# EAGLE design main (EAGLE 6.5.0)
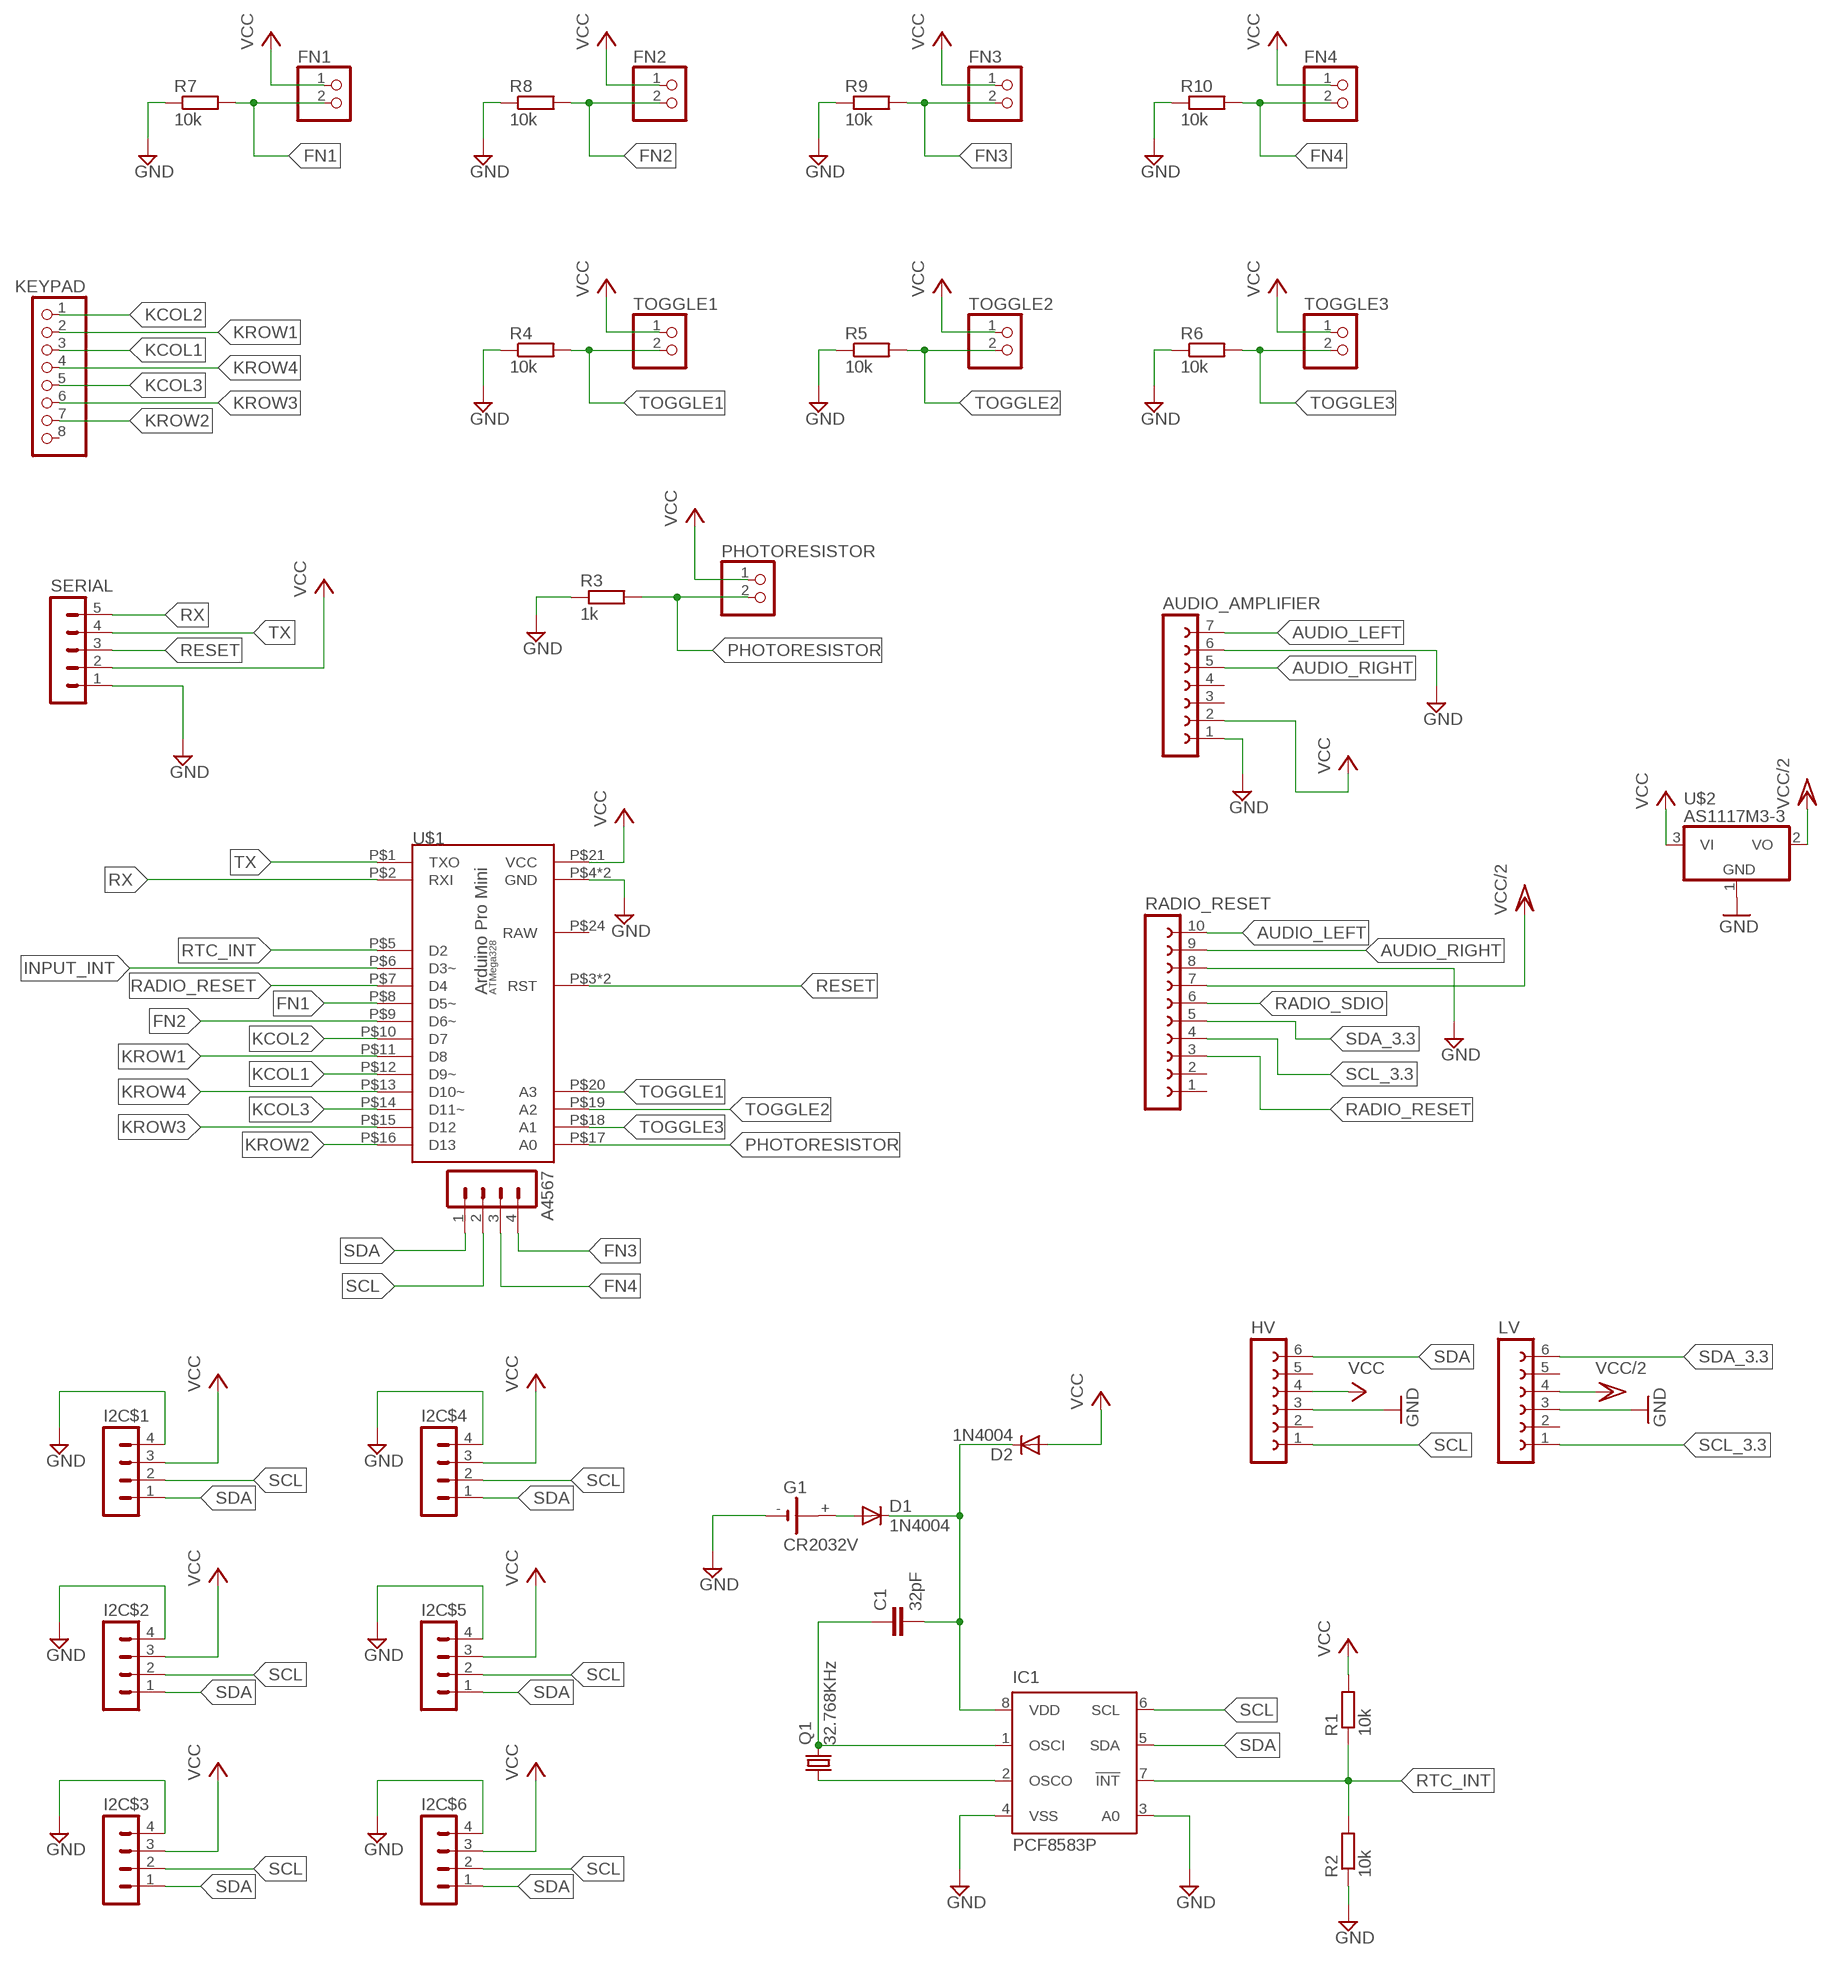
[diagram p0: schematic, sheet 1]

## Parts
A4567  MA04-1  [MA04-1]
AUDIO_AMPLIFIER  FE07-1  [FE07]
C1  32pF  C-EU025-024X044  [C025-024X044]
D1  1N4004  [DO41-10]
D2  1N4004  [DO41-10]
FN1  PINHD-1X2  [1X02]
FN2  PINHD-1X2  [1X02]
FN3  PINHD-1X2  [1X02]
FN4  PINHD-1X2  [1X02]
G1  CR2032V  [CR2032V]
HV  FE06-1  [FE06]
I2C$1  MA04-1  [MA04-1]
I2C$2  MA04-1  [MA04-1]
I2C$3  MA04-1  [MA04-1]
I2C$4  MA04-1  [MA04-1]
I2C$5  MA04-1  [MA04-1]
I2C$6  MA04-1  [MA04-1]
IC1  PCF8583P  [DIL08]
KEYPAD  PINHD-1X8  [1X08]
LV  FE06-1  [FE06]
PHOTORESISTOR  PINHD-1X2  [1X02]
Q1  32.768KHz  CRYSTALTC26H  [TC26H]
R1  10k  R-EU_M0805  [M0805]
R2  10k  R-EU_M0805  [M0805]
R3  1k  R-EU_M0805  [M0805]
R4  10k  R-EU_M0805  [M0805]
R5  10k  R-EU_M0805  [M0805]
R6  10k  R-EU_M0805  [M0805]
R7  10k  R-EU_M0805  [M0805]
R8  10k  R-EU_M0805  [M0805]
R9  10k  R-EU_M0805  [M0805]
R10  10k  R-EU_M0805  [M0805]
RADIO_RESET  FE10-1  [FE10]
SERIAL  MA05-1  [MA05-1]
TOGGLE1  PINHD-1X2  [1X02]
TOGGLE2  PINHD-1X2  [1X02]
TOGGLE3  PINHD-1X2  [1X02]
U$1  ARDUINO-PRO-MINI-BARE  [DIP24W]
U$2  AS1117M3-3  [SOT223]

## Nets
AUDIO_LEFT: AUDIO_AMPLIFIER.7 RADIO_RESET.10
AUDIO_RIGHT: AUDIO_AMPLIFIER.5 RADIO_RESET.9
FN1: FN1.2 R7.2 U$1.P$8(D5~)
FN2: FN2.2 R8.2 U$1.P$9(D6~)
FN3: A4567.4 FN3.2 R9.2
FN4: A4567.3 FN4.2 R10.2
GND: AUDIO_AMPLIFIER.1 AUDIO_AMPLIFIER.6 G1.- HV.3 I2C$1.4 I2C$2.4 I2C$3.4 I2C$4.4 I2C$5.4 I2C$6.4 IC1.3(A0) IC1.4(VSS) LV.3 R2.1 R3.1 R4.1 R5.1 R6.1 R7.1 R8.1 R9.1 R10.1 RADIO_RESET.8 SERIAL.1 U$1.P$4(GND) U$1.P$23(GND) U$2.1(GND)
INPUT_INT: U$1.P$6(D3~)
KCOL1: KEYPAD.3 U$1.P$12(D9~)
KCOL2: KEYPAD.1 U$1.P$10(D7)
KCOL3: KEYPAD.5 U$1.P$14(D11~)
KROW1: KEYPAD.2 U$1.P$11(D8)
KROW2: KEYPAD.7 U$1.P$16(D13)
KROW3: KEYPAD.6 U$1.P$15(D12)
KROW4: KEYPAD.4 U$1.P$13(D10~)
N$1: C1.1 IC1.1(OSCI) Q1.2
N$2: IC1.2(OSCO) Q1.1
N$3: D1.A G1.+
N$4: C1.2 D1.C D2.C IC1.8(VDD)
PHOTORESISTOR: PHOTORESISTOR.2 R3.2 U$1.P$17(A0)
RADIO_RESET: RADIO_RESET.3 U$1.P$7(D4)
RADIO_SDIO: RADIO_RESET.6
RESET: SERIAL.3 U$1.P$3(RST) U$1.P$22(RST)
RTC_INT: IC1.7(!INT) R1.1 R2.2 U$1.P$5(D2)
RX: SERIAL.5 U$1.P$2(RXI)
SCL: A4567.2 HV.1 I2C$1.2 I2C$2.2 I2C$3.2 I2C$4.2 I2C$5.2 I2C$6.2 IC1.6(SCL)
SCL_3.3: LV.1 RADIO_RESET.4
SDA: A4567.1 HV.6 I2C$1.1 I2C$2.1 I2C$3.1 I2C$4.1 I2C$5.1 I2C$6.1 IC1.5(SDA)
SDA_3.3: LV.6 RADIO_RESET.5
TOGGLE1: R4.2 TOGGLE1.2 U$1.P$20(A3)
TOGGLE2: R5.2 TOGGLE2.2 U$1.P$19(A2)
TOGGLE3: R6.2 TOGGLE3.2 U$1.P$18(A1)
TX: SERIAL.4 U$1.P$1(TXO)
VCC: AUDIO_AMPLIFIER.2 D2.A FN1.1 FN2.1 FN3.1 FN4.1 HV.4 I2C$1.3 I2C$2.3 I2C$3.3 I2C$4.3 I2C$5.3 I2C$6.3 PHOTORESISTOR.1 R1.2 SERIAL.2 TOGGLE1.1 TOGGLE2.1 TOGGLE3.1 U$1.P$21(VCC) U$2.3(VI)
VCC/2: LV.4 RADIO_RESET.7 U$2.2(VO)
Unconnected: AUDIO_AMPLIFIER.3 AUDIO_AMPLIFIER.4 G1.+@1(+) HV.2 HV.5 KEYPAD.8 LV.2 LV.5 RADIO_RESET.1 RADIO_RESET.2 U$1.P$24(RAW)

## Library data of the parts
A4567 I2C$1-I2C$6 = con-lstb:MA04-1: PIN HEADER; OC_FARNELL: unknown; OC_NEWARK: unknown
AUDIO_AMPLIFIER = con-lsta:FE07-1: FEMALE HEADER; OC_FARNELL: unknown; OC_NEWARK: unknown
C1 = rcl:C-EU: CAPACITOR, European symbol
D1 D2 = diode:1N4004: DIODE general purpose rectifier, 1 A
FN1-FN4 PHOTORESISTOR TOGGLE1-TOGGLE3 = pinhead:PINHD-1X2: PIN HEADER
G1 = battery:CR2032V: LI BATTERY Varta
HV LV = con-lsta:FE06-1: FEMALE HEADER; OC_FARNELL: unknown; OC_NEWARK: unknown
IC1 = ds1307_pcf8583:PCF8583: I2C-Bus CLOCK/CALENDAR
KEYPAD = pinhead:PINHD-1X8: PIN HEADER
Q1 = crystal:CRYSTAL: CRYSTAL; OC_FARNELL: unknown; OC_NEWARK: unknown
R1 R2 R4-R10 = resistor:R-EU_: RESISTOR, European symbol
R3 = rcl:R-EU_: RESISTOR, European symbol
RADIO_RESET = con-lsta:FE10-1: FEMALE HEADER; OC_FARNELL: unknown; OC_NEWARK: unknown
SERIAL = con-lstb:MA05-1: PIN HEADER; OC_FARNELL: unknown; OC_NEWARK: unknown
U$1 = arduino-pro-mini:ARDUINO-PRO-MINI-BARE
U$2 = linear_mod_by_bwa:AS1117M3-3

## Board
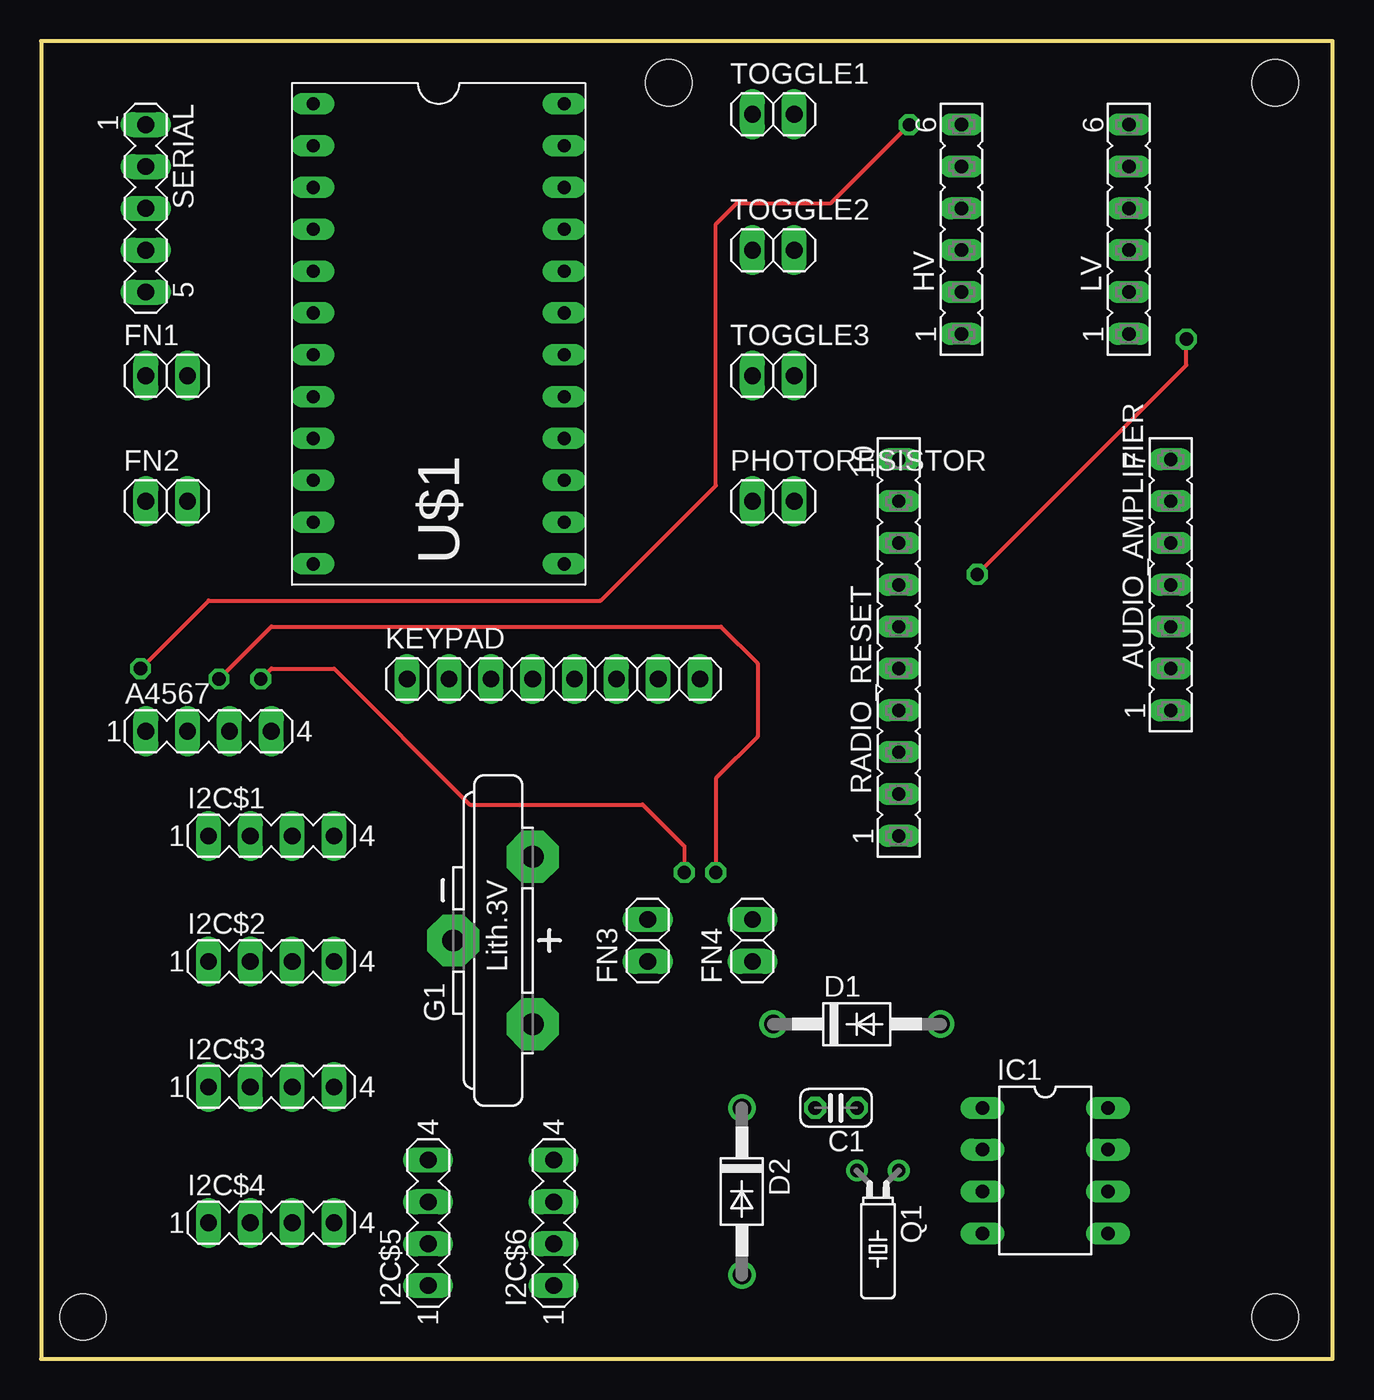
[diagram p1: board, top side]
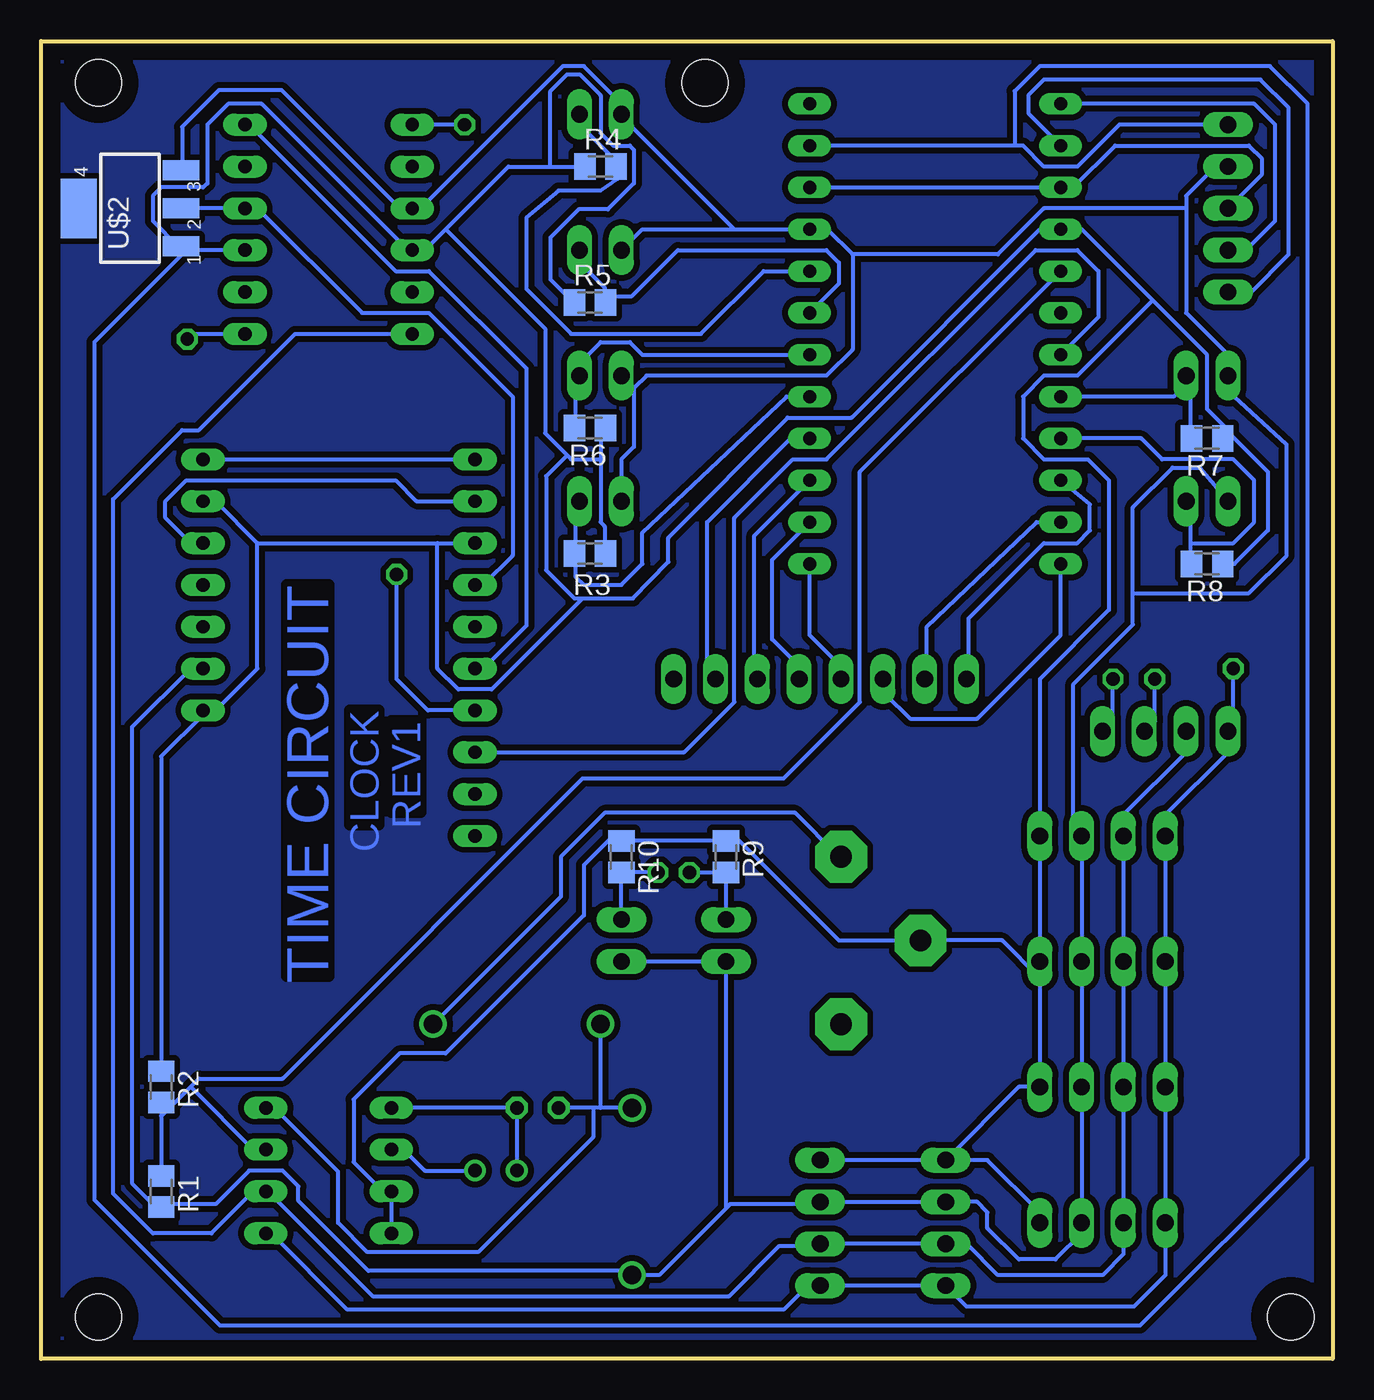
[diagram p2: board, bottom side, seen from below]

Size 78.41 x 80 mm. Coordinates in mm from the lower left corner, seen from the top.
Outline: 0,0 78.41,0 78.41,80 0,80 0,0
Copper layers (1*16): Top 0.035mm / dielectric 1.5mm / Bottom 0.035mm
Design rules "default *": minimum track width 10mil, minimum drill 24mil, track to track 14mil, track to pad 14mil, pad to pad 14mil, via to via 14mil, smd to smd 14mil, copper to edge 40mil, drill to drill 8mil, minimum pad ring 10mil, minimum via ring 8mil, stop-mask expansion 4mil, vias tented up to drill 0mil, thermal gap 10mil
Holes 2.8 mm at 74.93,77.47 2.54,2.54 74.93,2.54 38.1,77.47

### Footprints (pad centres in the part's own frame; a part is rotated, then mirrored left to right if it is on the bottom)
MA04-1 = drill 1.016 long: 1 -3.81,0; 2 -1.27,0; 3 1.27,0; 4 3.81,0
FE07 = drill 0.813 long: 1 -7.62,0; 2 -5.08,0; 3 -2.54,0; 4 0,0; 5 2.54,0; 6 5.08,0; 7 7.62,0
C025-024X044 = drill 0.813 octagon: 1 -1.27,0; 2 1.27,0
DO41-10 = drill 1.118: A 5.08,0; C -5.08,0
1X02 = drill 1.016 long: 1 -1.27,0; 2 1.27,0
CR2032V = drill 1.321 pad 3.15 octagon: + -2.54,-5.08; +@1 -2.54,5.08; - 2.286,0
FE06 = drill 0.813 long: 1 -6.35,0; 2 -3.81,0; 3 -1.27,0; 4 1.27,0; 5 3.81,0; 6 6.35,0
DIL08 = drill 0.813 long: 1 -3.81,-3.81; 2 -1.27,-3.81; 3 1.27,-3.81; 4 3.81,-3.81; 5 3.81,3.81; 6 1.27,3.81; 7 -1.27,3.81; 8 -3.81,3.81
1X08 = drill 1.016 long: 1 -8.89,0; 2 -6.35,0; 3 -3.81,0; 4 -1.27,0; 5 1.27,0; 6 3.81,0; 7 6.35,0; 8 8.89,0
TC26H = drill 0.813: 1 -1.27,0; 2 1.27,0
M0805 = smd 1.3 x 1.6: 1 -0.95,0; 2 0.95,0
FE10 = drill 0.813 long: 1 -11.43,0; 2 -8.89,0; 3 -6.35,0; 4 -3.81,0; 5 -1.27,0; 6 1.27,0; 7 3.81,0; 8 6.35,0; 9 8.89,0; 10 11.43,0
MA05-1 = drill 1.016 long: 1 -5.08,0; 2 -2.54,0; 3 0,0; 4 2.54,0; 5 5.08,0
DIP24W = drill 0.8 pad 1.27 long: P$1 -7.62,13.97; P$2 -7.62,11.43; P$3 -7.62,8.89; P$4 -7.62,6.35; P$5 -7.62,3.81; P$6 -7.62,1.27; P$7 -7.62,-1.27; P$8 -7.62,-3.81; P$9 -7.62,-6.35; P$10 -7.62,-8.89; P$11 -7.62,-11.43; P$12 -7.62,-13.97; P$13 7.62,-13.97; P$14 7.62,-11.43; P$15 7.62,-8.89; P$16 7.62,-6.35; P$17 7.62,-3.81; P$18 7.62,-1.27; P$19 7.62,1.27; P$20 7.62,3.81; P$21 7.62,6.35; P$22 7.62,8.89; P$23 7.62,11.43; P$24 7.62,13.97
SOT223 = smd 1.219 x 2.235: 1 -2.311,-3.099; 2 0,-3.099; 3 2.311,-3.099 | smd 3.6 x 2.2: 4 0,3.099

### Placement (x,y rotation side)
A4567  10.16,38.1 0 top
AUDIO_AMPLIFIER  68.58,46.99 90 top
C1  48.26,15.24 180 top
D1  49.53,20.32 0 top
D2  42.55,10.16 270 top
FN1  7.62,59.69 0 top
FN2  7.62,52.07 0 top
FN3  36.83,25.4 90 top
FN4  43.18,25.4 90 top
G1  27.3,25.4 180 top
HV  55.88,68.58 90 top
I2C$1  13.97,31.75 0 top
I2C$2  13.97,24.13 0 top
I2C$3  13.97,16.51 0 top
I2C$4  13.97,8.26 0 top
I2C$5  23.5,8.26 90 top
I2C$6  31.11,8.26 90 top
IC1  60.96,11.43 270 top
KEYPAD  31.11,41.27 0 top
LV  66.04,68.58 90 top
PHOTORESISTOR  44.45,52.07 0 top
Q1  50.8,11.43 180 top
R1  71.12,10.16 270 bottom
R2  71.12,16.51 270 bottom
R3  45.09,48.9 180 bottom
R4  44.45,72.39 0 bottom
R5  45.09,64.14 0 bottom
R6  45.09,56.52 180 bottom
R7  7.62,55.88 180 bottom
R8  7.62,48.26 180 bottom
R9  36.83,30.48 270 bottom
R10  43.18,30.48 270 bottom
RADIO_RESET  52.07,43.18 90 top
SERIAL  6.35,69.85 270 top
TOGGLE1  44.45,75.56 0 top
TOGGLE2  44.45,67.31 0 top
TOGGLE3  44.45,59.69 0 top
U$1  24.13,62.23 0 top
U$2  73.03,69.85 90 bottom

### Tracks (layer width: path | path; a pad name or v marks a point on that pad's centre or on a via)
AUDIO_LEFT
  Bottom 0.254: AUDIO_AMPLIFIER.7 RADIO_RESET.10
AUDIO_RIGHT
  Bottom 0.254: RADIO_RESET.9 55.63,52.07 56.9,53.34 69.6,53.34 70.87,52.07 70.87,51.05 69.34,49.53 AUDIO_AMPLIFIER.5
FN1
  Bottom 0.254: 8.64,59.44 8.64,55.88 R7.2 | U$1.P$8 9.65,58.42 8.64,59.44 | 8.64,59.44 FN1.2
FN2
  Bottom 0.254: 8.64,49.53 8.64,51.82 FN2.2 | 8.64,49.53 8.64,48.26 R8.2 | U$1.P$9 11.62,55.88 10.35,54.61 6.03,54.61 4.76,53.34 4.76,50.8 6.03,49.53 8.64,49.53
FN3  (via drill 0.8 pad 1.27)
  Top 0.254: v13.34,41.27 13.97,41.91 17.78,41.91 26.04,33.66 36.51,33.66 39.05,31.11 v39.05,29.53
  Bottom 0.254: FN3.2 R9.2 38.73,29.53 v39.05,29.53 | A4567.4 13.34,38.73 v13.34,41.27
FN4  (via drill 0.8 pad 1.27)
  Top 0.254: v10.79,41.27 13.97,44.45 41.27,44.45 43.5,42.23 43.5,37.78 40.96,35.24 v40.96,29.53
  Bottom 0.254: FN4.2 R10.2 41.28,29.53 v40.96,29.53 | A4567.3 10.79,38.73 v10.79,41.27
GND
  Bottom 0.254: 17.78,23.11 I2C$3.4 19.05,16.51 I2C$5.4 | I2C$5.4 I2C$6.4 | I2C$4.4 17.78,8.89 20.95,12.06 I2C$5.4 | 17.78,23.11 20.07,25.4 G1.- 29.97,25.4 36.07,31.5 36.83,31.5 | 17.78,23.11 I2C$2.4 I2C$1.4 17.78,41.27 13.59,45.47 13.59,53.34 14.86,54.61 17.53,54.61 18.8,55.88 18.8,58.42 17.53,59.69 15.49,59.69 10.92,64.26 | IC1.4 IC1.3 57.66,10.16 59.44,11.94 59.44,15.75 56.64,18.54 53.85,18.54 45.47,26.92 45.47,29.97 43.94,31.5 43.18,31.5 | 43.18,31.5 36.83,31.5 | 43.18,31.5 R10.1 | 36.83,31.5 R9.1 | 65.28,49.53 54.36,49.53 | 54.36,49.53 RADIO_RESET.8 | 65.28,49.53 67.82,52.07 AUDIO_AMPLIFIER.6 | R2.1 71.12,36.58 68.58,39.12 AUDIO_AMPLIFIER.1 67.82,39.37 65.28,41.91 65.28,49.53 | 5.97,55.88 3.94,53.85 3.94,50.29 5.97,48.26 R8.1 | 10.92,64.26 7.62,60.96 7.62,57.66 6.6,56.64 5.97,55.88 | 10.92,64.26 15.24,68.58 U$1.P$4 17.78,68.58 29.21,57.15 33.08,57.15 40.32,49.85 40.32,48.39 42.48,46.16 45.53,46.16 | 5.97,55.88 R7.1 | 19.3,73.66 18.8,73.66 17.53,72.39 15.49,72.39 12.95,74.93 SERIAL.1 | 19.3,73.66 U$1.P$23 | 44.45,54.61 44.45,56.13 44.2,56.39 R6.1 | 44.45,54.61 44.45,50.8 44.2,50.55 44.2,49.02 R3.1 | LV.3 69.6,67.31 | 69.6,67.31 69.85,67.31 U$2.1 | 47.5,72.39 50.04,72.39 53.85,68.58 | 47.5,72.39 R4.1 | 53.85,68.58 55.12,67.31 HV.3 56.13,67.31 65.02,76.2 67.06,76.2 68.33,74.93 68.33,71.37 68.58,71.12 71.12,71.12 71.63,70.61 71.63,69.09 70.1,67.56 U$2.1 | 47.5,72.39 47.5,76.96 46.48,77.98 45.72,77.98 44.45,76.71 44.45,74.42 43.69,73.66 42.67,73.66 42.42,73.41 42.42,71.37 44.01,69.79 45.78,69.79 47.5,68.07 47.5,65.53 46.23,64.26 R5.1 | 44.45,54.61 46.23,54.61 46.48,54.86 | 46.48,54.86 47.82,56.2 47.82,62.55 53.85,68.58
  Bottom 0.254: 19.3,73.66 19.3,76.96 17.78,78.49 3.81,78.49 1.52,76.2 1.52,12.19 11.68,2.03 67.56,2.03 75.18,9.65 75.18,61.72 69.6,67.31 | 69.6,67.31 U$2.1 | 45.53,46.16 46.04,46.16 47.75,47.88 47.75,53.59 46.48,54.86 | 54.36,49.53 54.36,41.91 53.09,40.64 51.05,40.64 45.53,46.16
KCOL1
  Bottom 0.254: U$1.P$12 16.51,43.94 21.59,38.86 25.65,38.86 27.18,40.39 27.18,41.15 KEYPAD.3
KCOL2
  Bottom 0.254: U$1.P$10 14.73,51.88 14.73,50.29 15.49,49.53 17.53,49.53 22.1,44.96 22.1,41.4 KEYPAD.1
KCOL3
  Bottom 0.254: U$1.P$14 34.04,48.51 34.04,43.69 32.51,42.16 32.51,41.4 KEYPAD.5
KROW1
  Bottom 0.254: U$1.P$11 17.97,50.8 24.64,44.45 24.64,41.4 KEYPAD.2
KROW2
  Bottom 0.254: U$1.P$16 32.89,55.88 37.97,50.8 37.97,41.72 KEYPAD.7
KROW3
  Bottom 0.254: U$1.P$15 35.12,49.97 35.12,41.08 KEYPAD.6
KROW4
  Bottom 0.254: U$1.P$13 31.75,43.94 29.97,42.16 29.97,41.4 KEYPAD.4
N$1
  Bottom 0.254: Q1.2 C1.1 IC1.1
N$2
  Bottom 0.254: Q1.1 55.12,11.43 56.39,12.7 IC1.2
N$3
  Bottom 0.254: D1.A 46.86,28.07 46.86,30.48 44.2,33.15 32.64,33.15 29.97,30.48 G1.+
N$4
  Bottom 0.254: D2.C 44.45,15.24 | 44.45,15.24 44.9,15.24 | 44.9,15.24 C1.2 | IC1.8 64.26,15.24 60.39,11.37 60.39,8.26 58.61,6.48 51.88,6.48 44.9,13.46 44.9,15.24 | 44.45,15.24 D1.C
N$5
  pour Bottom: 0,80.01 77.47,80.01 77.47,0 0,0
PHOTORESISTOR
  Bottom 0.254: PHOTORESISTOR.2 45.97,51.82 45.97,49.02 R3.2 45.97,48.77 45.97,47.5 45.47,46.99 43.18,46.99 41.91,48.26 41.91,50.16 33.15,58.42 U$1.P$17
RADIO_RESET
  Bottom 0.254: U$1.P$7 14.22,63.25 14.22,66.04 15.49,67.31 18.03,67.31 30.73,54.61 32.77,54.61 36.32,51.05 36.32,39.88 39.37,36.83 RADIO_RESET.3
RESET
  Bottom 0.254: U$1.P$22 U$1.P$3 15.75,71.12 13.21,73.66 5.08,73.66 4.32,72.9 4.32,71.88 SERIAL.3
RTC_INT
  Bottom 0.254: R2.2 71.12,14.73 | 71.12,14.73 R1.1 | U$1.P$5 28.7,53.85 28.7,39.88 33.34,35.24 45.53,35.24 63.75,17.02 68.83,17.02 69.34,16.51 | 71.12,14.73 69.34,16.51 | IC1.7 65.53,12.7 69.34,16.51
RX
  Bottom 0.254: U$1.P$2 18.48,75.63 18.48,76.71 17.53,77.66 4.38,77.66 2.67,75.95 2.67,67.06 4.95,64.77 SERIAL.5
SCL
  Bottom 0.254: A4567.2 8.89,36.83 12.7,33.02 I2C$1.2 I2C$2.2 I2C$3.2 I2C$4.2 12.7,6.35 13.97,5.08 20.32,5.08 22.23,6.99 I2C$5.2 I2C$6.2 31.24,6.86 33.59,6.86 36.64,3.81 58.29,3.81 64.64,10.16 IC1.6 65.53,10.16 68.07,7.62 71.63,7.62 74.04,10.03 74.04,52.2 69.85,56.39 68.83,56.39 62.99,62.23 HV.1
SCL_3.3  (via drill 0.8 pad 1.27)
  Top 0.254: v56.83,47.62 69.53,60.33 v69.53,61.91
  Bottom 0.254: RADIO_RESET.4 54.93,39.37 56.83,41.27 v56.83,47.62 | v69.53,61.91 69.22,62.23 LV.1
SDA  (via drill 0.8 pad 1.27)
  Top 0.254: v6.03,41.91 10.16,46.04 33.97,46.04 40.96,53.02 40.96,68.9 42.23,70.17 47.94,70.17 v52.7,74.93
  Bottom 0.254: IC1.5 64.45,7.62 59.82,2.98 33.34,2.98 32,4.32 31.24,4.32 I2C$6.1 I2C$5.1 22.23,3.17 12.06,3.17 10.16,5.08 I2C$4.1 I2C$3.1 I2C$2.1 I2C$1.1 10.16,33.02 6.35,36.83 A4567.1 6.03,38.42 v6.03,41.91 | v52.7,74.93 HV.6
SDA_3.3
  Bottom 0.254: RADIO_RESET.5 51.56,41.91 48.96,44.51 48.96,60.13 54.86,66.04 56.9,66.04 65.79,74.93 LV.6
TOGGLE1
  Bottom 0.254: TOGGLE1.2 45.72,74.93 43.69,72.9 43.69,72.39 R4.2 43.43,72.39 43.43,71.63 44.45,70.93 46.99,70.93 48.96,69.28 48.96,64.96 46.23,62.23 38.35,62.23 34.54,66.04 U$1.P$20
TOGGLE2
  Bottom 0.254: 44.2,64.52 44.2,65.02 45.72,66.55 TOGGLE2.2 | 44.2,64.52 44.2,64.26 R5.2 44.2,64.52 | U$1.P$19 29.97,65.28 29.97,66.55 30.73,67.31 39.75,67.31 42.55,64.52 44.2,64.52
TOGGLE3
  Bottom 0.254: R6.2 45.97,56.64 45.97,59.44 TOGGLE3.2 45.72,60.45 44.45,61.72 42.67,61.72 41.91,60.96 U$1.P$18
TX
  Bottom 0.254: U$1.P$1 4.76,76.2 3.49,74.93 3.49,69.09 5.27,67.31 SERIAL.4
VCC
  Bottom 0.254: U$2.3 69.85,72.39 69.85,74.8 67.63,77.03 63.82,77.03 56.64,69.85 HV.4 55.37,69.85 46.74,78.49 45.47,78.49 43.18,76.2 TOGGLE1.1 43.18,75.44 36.32,68.58 | PHOTORESISTOR.1 43.18,54.61 42.42,55.37 42.42,58.93 | TOGGLE3.1 42.42,58.93 | 36.32,68.58 41.91,68.58 TOGGLE2.1 | 36.32,68.58 U$1.P$21 30.67,68.58 29.15,67.06 | 42.42,58.93 41.66,59.69 30.73,59.69 29.15,61.28 29.15,67.06 | 71.12,9.4 71.63,9.4 72.9,10.67 72.9,38.35 69.34,41.91 AUDIO_AMPLIFIER.2 | 8.89,69.85 8.89,70.61 7.11,72.39 SERIAL.2 | 8.89,69.85 8.89,63.5 6.35,60.96 FN1.1 6.35,58.74 2.79,55.5 2.79,48.77 5.08,46.48 12.13,46.48 | FN4.1 FN3.1 36.83,9.14 | FN2.1 8.06,54.1 9.72,54.1 12.13,51.69 12.13,46.48 | 12.13,46.48 12.13,44.58 15.75,40.96 15.75,32.26 I2C$1.3 I2C$2.3 I2C$3.3 I2C$4.3 15.24,7.62 16.83,6.03 19.05,6.03 20.95,7.94 20.95,8.89 21.59,9.53 I2C$5.3 I2C$6.3 31.24,9.4 36.58,9.4 36.83,9.14 | 36.83,9.14 40.89,5.08 D2.A 42.67,5.08 42.93,5.33 58.55,5.33 62.8,9.59 62.8,10.48 63.75,11.43 65.79,11.43 67.82,9.4 71.12,9.4 | 71.12,9.4 R1.2 | 29.15,67.06 20.32,67.06 17.53,69.85 8.89,69.85
VCC/2
  Bottom 0.254: U$2.2 LV.4 65.28,69.85 58.93,63.5 54.86,63.5 49.78,58.42 49.78,48.77 51.56,46.99 RADIO_RESET.7

### Text on the board
Bottom: TIME CIRCUIT | REV1 | CLOCK